# Altium schematic sheet Группа 3.SchDoc
size 420 x 297 mm
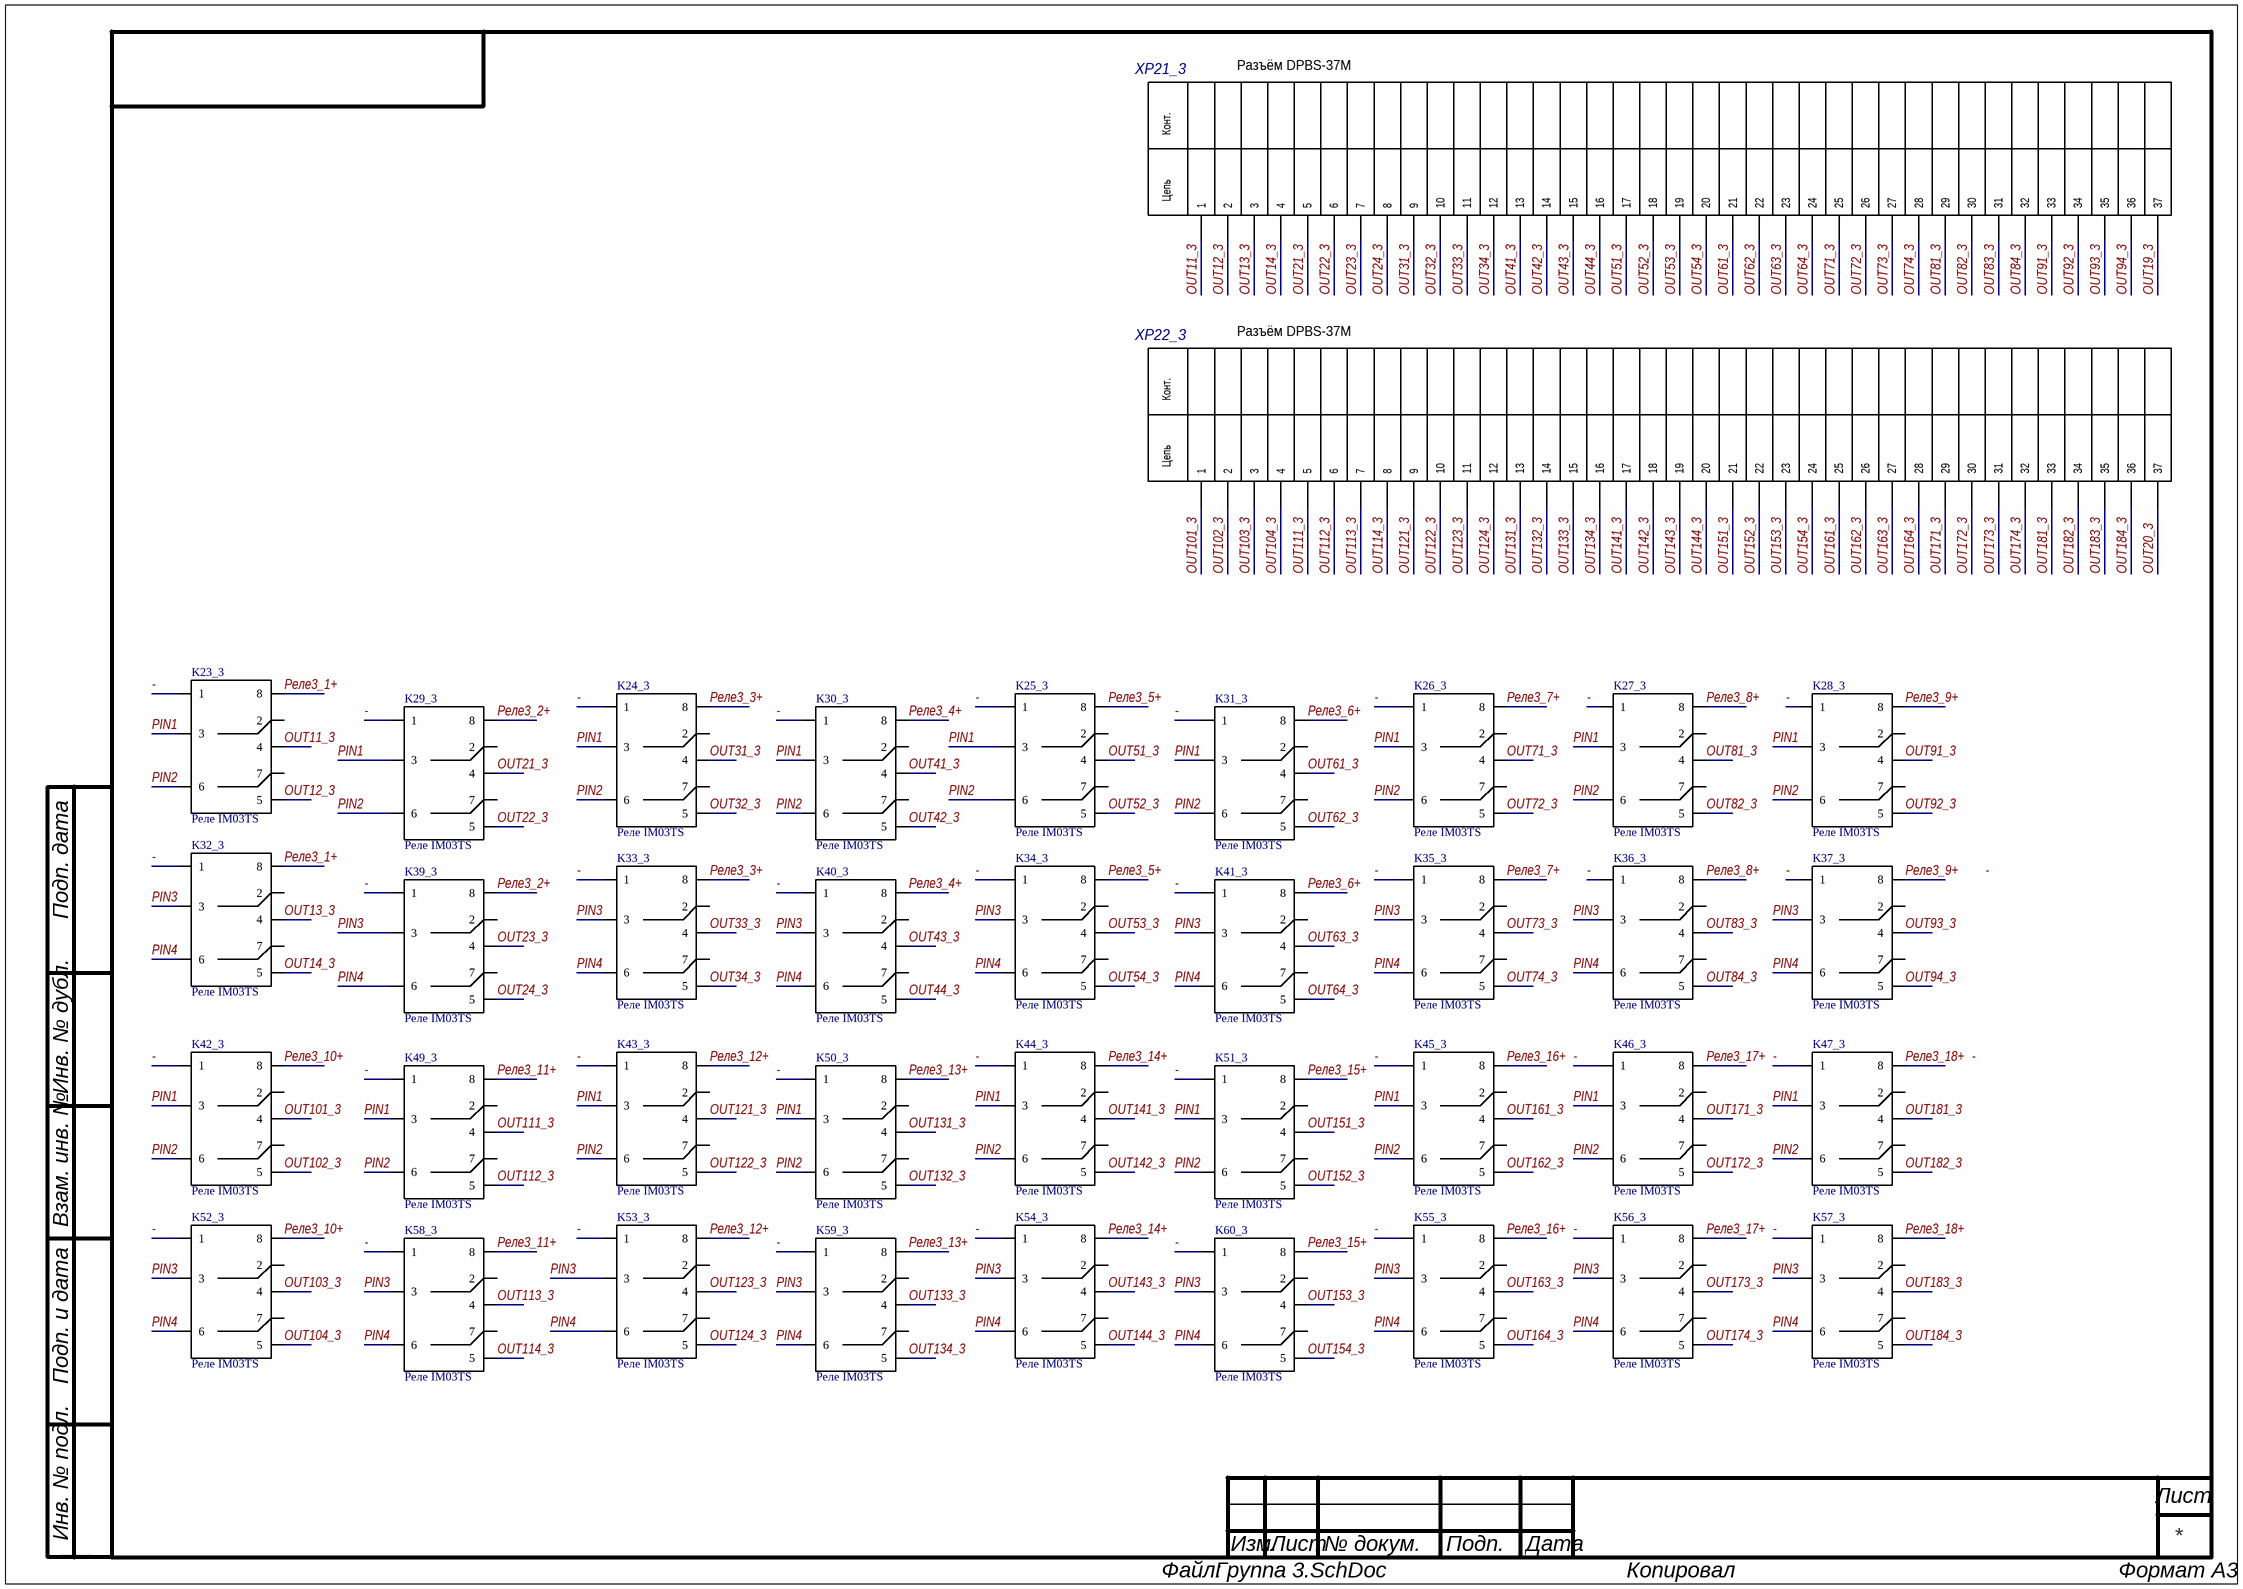
[diagram p0: Группа 3.SchDoc]

## Parts
K23_3  Реле IM03TS  [IM03TS]
K24_3  Реле IM03TS  [IM03TS]
K25_3  Реле IM03TS  [IM03TS]
K26_3  Реле IM03TS  [IM03TS]
K27_3  Реле IM03TS  [IM03TS]
K28_3  Реле IM03TS  [IM03TS]
K29_3  Реле IM03TS  [IM03TS]
K30_3  Реле IM03TS  [IM03TS]
K31_3  Реле IM03TS  [IM03TS]
K32_3  Реле IM03TS  [IM03TS]
K33_3  Реле IM03TS  [IM03TS]
K34_3  Реле IM03TS  [IM03TS]
K35_3  Реле IM03TS  [IM03TS]
K36_3  Реле IM03TS  [IM03TS]
K37_3  Реле IM03TS  [IM03TS]
K39_3  Реле IM03TS  [IM03TS]
K40_3  Реле IM03TS  [IM03TS]
K41_3  Реле IM03TS  [IM03TS]
K42_3  Реле IM03TS  [IM03TS]
K43_3  Реле IM03TS  [IM03TS]
K44_3  Реле IM03TS  [IM03TS]
K45_3  Реле IM03TS  [IM03TS]
K46_3  Реле IM03TS  [IM03TS]
K47_3  Реле IM03TS  [IM03TS]
K49_3  Реле IM03TS  [IM03TS]
K50_3  Реле IM03TS  [IM03TS]
K51_3  Реле IM03TS  [IM03TS]
K52_3  Реле IM03TS  [IM03TS]
K53_3  Реле IM03TS  [IM03TS]
K54_3  Реле IM03TS  [IM03TS]
K55_3  Реле IM03TS  [IM03TS]
K56_3  Реле IM03TS  [IM03TS]
K57_3  Реле IM03TS  [IM03TS]
K58_3  Реле IM03TS  [IM03TS]
K59_3  Реле IM03TS  [IM03TS]
K60_3  Реле IM03TS  [IM03TS]
XP21_3  Разъём DPBS-37M  [DPBS-37M]
XP22_3  Разъём DPBS-37M  [DPBS-37M]

## Nets
-: K23_3.1 K24_3.1 K25_3.1 K26_3.1 K27_3.1 K28_3.1 K29_3.1 K30_3.1 K31_3.1 K32_3.1 K33_3.1 K34_3.1 K35_3.1 K36_3.1 K37_3.1 K39_3.1 K40_3.1 K41_3.1 K42_3.1 K43_3.1 K44_3.1 K45_3.1 K46_3.1 K47_3.1 K49_3.1 K50_3.1 K51_3.1 K52_3.1 K53_3.1 K54_3.1 K55_3.1 K56_3.1 K57_3.1 K58_3.1 K59_3.1 K60_3.1
OUT11_3: K23_3.4 XP21_3.1
OUT12_3: K23_3.5 XP21_3.2
OUT13_3: K32_3.4 XP21_3.3
OUT14_3: K32_3.5 XP21_3.4
OUT19_3: XP21_3.37
OUT20_3: XP22_3.37
OUT21_3: K29_3.4 XP21_3.5
OUT22_3: K29_3.5 XP21_3.6
OUT23_3: K39_3.4 XP21_3.7
OUT24_3: K39_3.5 XP21_3.8
OUT31_3: K24_3.4 XP21_3.9
OUT32_3: K24_3.5 XP21_3.10
OUT33_3: K33_3.4 XP21_3.11
OUT34_3: K33_3.5 XP21_3.12
OUT41_3: K30_3.4 XP21_3.13
OUT42_3: K30_3.5 XP21_3.14
OUT43_3: K40_3.4 XP21_3.15
OUT44_3: K40_3.5 XP21_3.16
OUT51_3: K25_3.4 XP21_3.17
OUT52_3: K25_3.5 XP21_3.18
OUT53_3: K34_3.4 XP21_3.19
OUT54_3: K34_3.5 XP21_3.20
OUT61_3: K31_3.4 XP21_3.21
OUT62_3: K31_3.5 XP21_3.22
OUT63_3: K41_3.4 XP21_3.23
OUT64_3: K41_3.5 XP21_3.24
OUT71_3: K26_3.4 XP21_3.25
OUT72_3: K26_3.5 XP21_3.26
OUT73_3: K35_3.4 XP21_3.27
OUT74_3: K35_3.5 XP21_3.28
OUT81_3: K27_3.4 XP21_3.29
OUT82_3: K27_3.5 XP21_3.30
OUT83_3: K36_3.4 XP21_3.31
OUT84_3: K36_3.5 XP21_3.32
OUT91_3: K28_3.4 XP21_3.33
OUT92_3: K28_3.5 XP21_3.34
OUT93_3: K37_3.4 XP21_3.35
OUT94_3: K37_3.5 XP21_3.36
OUT101_3: K42_3.4 XP22_3.1
OUT102_3: K42_3.5 XP22_3.2
OUT103_3: K52_3.4 XP22_3.3
OUT104_3: K52_3.5 XP22_3.4
OUT111_3: K49_3.4 XP22_3.5
OUT112_3: K49_3.5 XP22_3.6
OUT113_3: K58_3.4 XP22_3.7
OUT114_3: K58_3.5 XP22_3.8
OUT121_3: K43_3.4 XP22_3.9
OUT122_3: K43_3.5 XP22_3.10
OUT123_3: K53_3.4 XP22_3.11
OUT124_3: K53_3.5 XP22_3.12
OUT131_3: K50_3.4 XP22_3.13
OUT132_3: K50_3.5 XP22_3.14
OUT133_3: K59_3.4 XP22_3.15
OUT134_3: K59_3.5 XP22_3.16
OUT141_3: K44_3.4 XP22_3.17
OUT142_3: K44_3.5 XP22_3.18
OUT143_3: K54_3.4 XP22_3.19
OUT144_3: K54_3.5 XP22_3.20
OUT151_3: K51_3.4 XP22_3.21
OUT152_3: K51_3.5 XP22_3.22
OUT153_3: K60_3.4 XP22_3.23
OUT154_3: K60_3.5 XP22_3.24
OUT161_3: K45_3.4 XP22_3.25
OUT162_3: K45_3.5 XP22_3.26
OUT163_3: K55_3.4 XP22_3.27
OUT164_3: K55_3.5 XP22_3.28
OUT171_3: K46_3.4 XP22_3.29
OUT172_3: K46_3.5 XP22_3.30
OUT173_3: K56_3.4 XP22_3.31
OUT174_3: K56_3.5 XP22_3.32
OUT181_3: K47_3.4 XP22_3.33
OUT182_3: K47_3.5 XP22_3.34
OUT183_3: K57_3.4 XP22_3.35
OUT184_3: K57_3.5 XP22_3.36
PIN1: K23_3.3 K24_3.3 K25_3.3 K26_3.3 K27_3.3 K28_3.3 K29_3.3 K30_3.3 K31_3.3 K42_3.3 K43_3.3 K44_3.3 K45_3.3 K46_3.3 K47_3.3 K49_3.3 K50_3.3 K51_3.3
PIN2: K23_3.6 K24_3.6 K25_3.6 K26_3.6 K27_3.6 K28_3.6 K29_3.6 K30_3.6 K31_3.6 K42_3.6 K43_3.6 K44_3.6 K45_3.6 K46_3.6 K47_3.6 K49_3.6 K50_3.6 K51_3.6
PIN3: K32_3.3 K33_3.3 K34_3.3 K35_3.3 K36_3.3 K37_3.3 K39_3.3 K40_3.3 K41_3.3 K52_3.3 K53_3.3 K54_3.3 K55_3.3 K56_3.3 K57_3.3 K58_3.3 K59_3.3 K60_3.3
PIN4: K32_3.6 K33_3.6 K34_3.6 K35_3.6 K36_3.6 K37_3.6 K39_3.6 K40_3.6 K41_3.6 K52_3.6 K53_3.6 K54_3.6 K55_3.6 K56_3.6 K57_3.6 K58_3.6 K59_3.6 K60_3.6
Реле3_1+: K23_3.8 K32_3.8
Реле3_2+: K29_3.8 K39_3.8
Реле3_3+: K24_3.8 K33_3.8
Реле3_4+: K30_3.8 K40_3.8
Реле3_5+: K25_3.8 K34_3.8
Реле3_6+: K31_3.8 K41_3.8
Реле3_7+: K26_3.8 K35_3.8
Реле3_8+: K27_3.8 K36_3.8
Реле3_9+: K28_3.8 K37_3.8
Реле3_10+: K42_3.8 K52_3.8
Реле3_11+: K49_3.8 K58_3.8
Реле3_12+: K43_3.8 K53_3.8
Реле3_13+: K50_3.8 K59_3.8
Реле3_14+: K44_3.8 K54_3.8
Реле3_15+: K51_3.8 K60_3.8
Реле3_16+: K45_3.8 K55_3.8
Реле3_17+: K46_3.8 K56_3.8
Реле3_18+: K47_3.8 K57_3.8

Not connected (* = marked no-connect by the designer): K23_3 2 7; K24_3 2 7; K25_3 2 7; K26_3 2 7; K27_3 2 7; K28_3 2 7; K29_3 2 7; K30_3 2 7; K31_3 2 7; K32_3 2 7; K33_3 2 7; K34_3 2 7; K35_3 2 7; K36_3 2 7; K37_3 2 7; K39_3 2 7; K40_3 2 7; K41_3 2 7; K42_3 2 7; K43_3 2 7; K44_3 2 7; K45_3 2 7; K46_3 2 7; K47_3 2 7; K49_3 2 7; K50_3 2 7; K51_3 2 7; K52_3 2 7; K53_3 2 7; K54_3 2 7; K55_3 2 7; K56_3 2 7; K57_3 2 7; K58_3 2 7; K59_3 2 7; K60_3 2 7

## Notes on the sheet
- Labels drawn without touching a wire or pin: -
- Подп. дата
- Инв. № дубл.
- Взам. инв. №
- Подп. и дата
- Инв. № подл.
- Изм.
- Лист
- № докум.
- Подп.
- Дата
- ALTIUM GOSTBOM2.0 KEV
- Файл:
- Копировал
- Формат А3
- (in symbol DPBS-37M) Конт.; Цепь

## Library data of the parts
K23_3 K24_3 K25_3 K26_3 K27_3 K28_3 K29_3 K30_3 K31_3 K32_3 K33_3 K34_3 K35_3 K36_3 K37_3 K39_3 K40_3 K41_3 K42_3 K43_3 K44_3 K45_3 K46_3 K47_3 K49_3 K50_3 K51_3 K52_3 K53_3 K54_3 K55_3 K56_3 K57_3 K58_3 K59_3 K60_3 = IM03TS: Реле
XP21_3 XP22_3 = DPBS-37M